# EAGLE schematic LowTemp_singleboard (EAGLE 6.4)
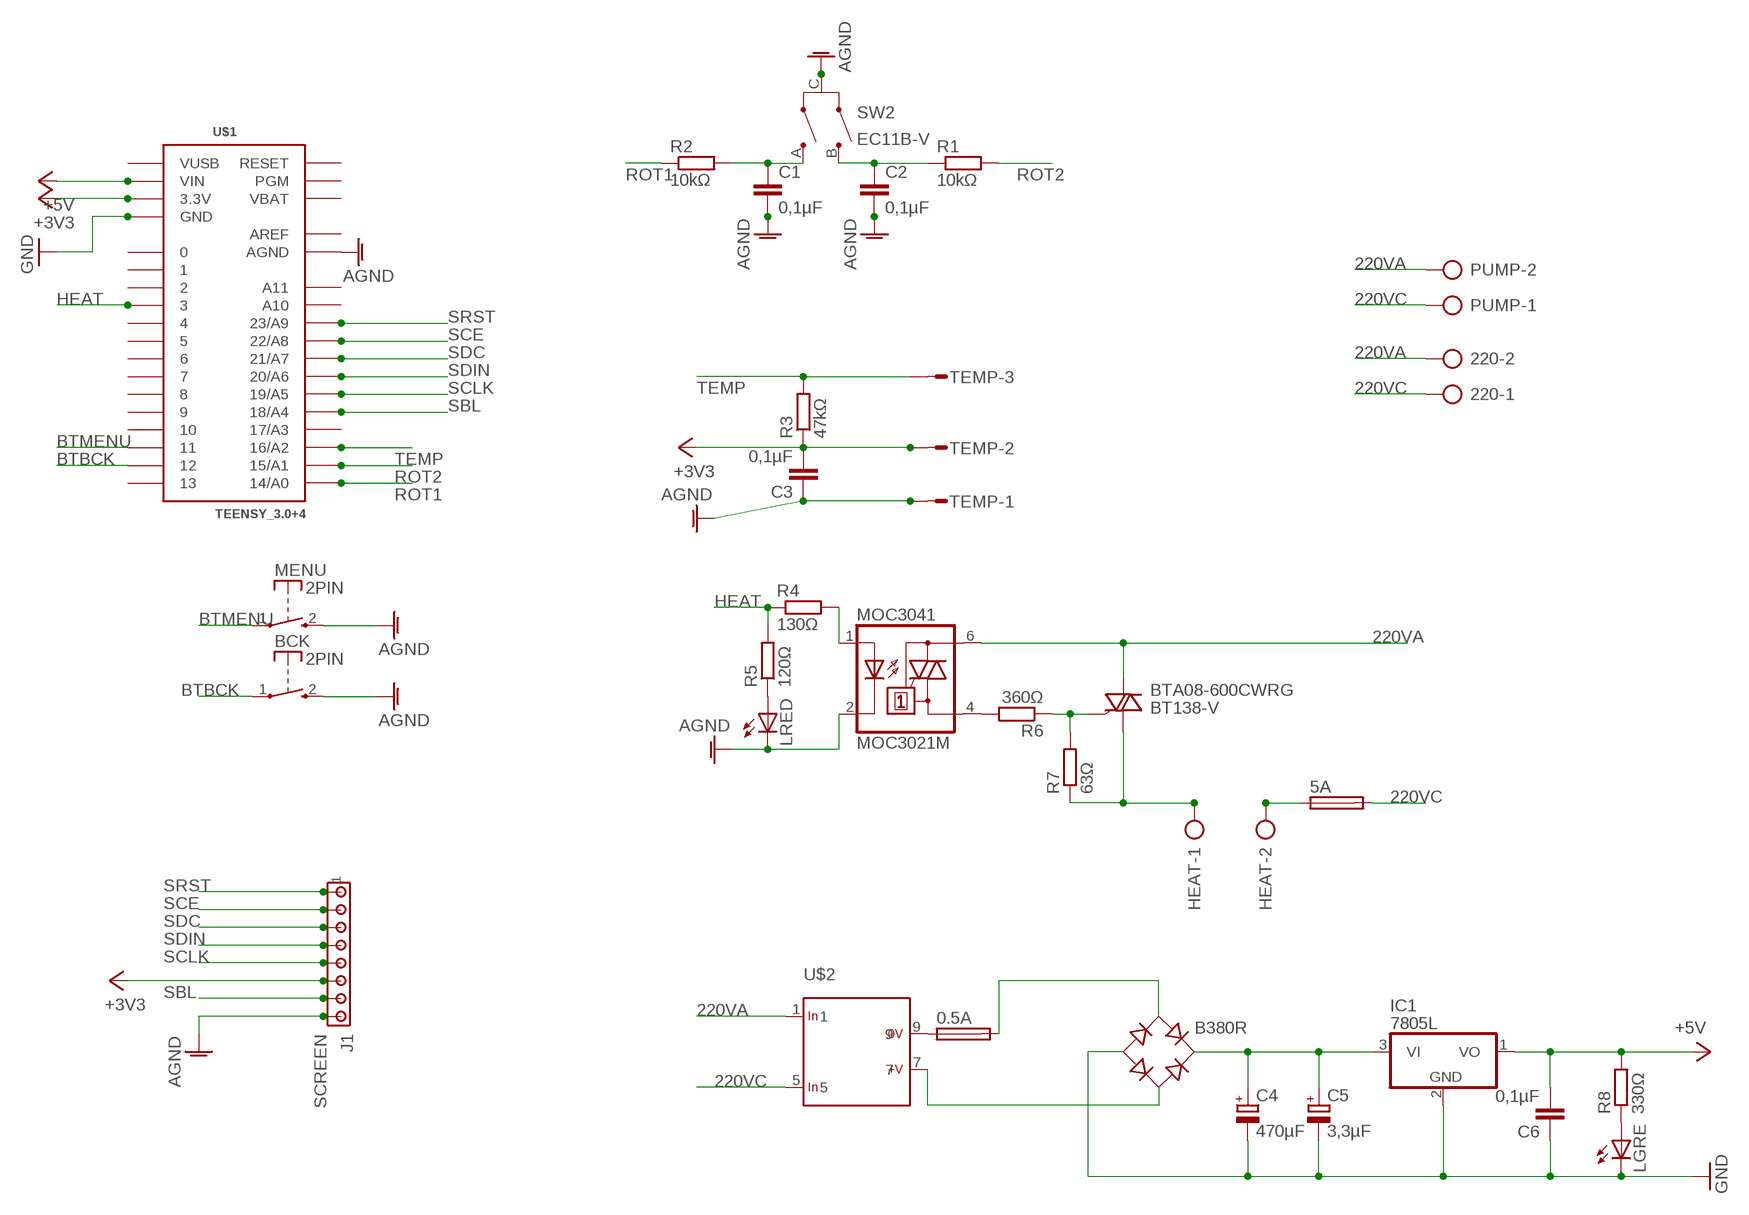
[diagram p0: schematic, sheet 1]

## Parts
0.5A  SH22,5A  [SH22,5A]
5A  SH22,5A  [SH22,5A]
220  AK500/2-H  [AK500/2-H]
B380R  RB1A  [RB1A]
BCK  2PIN  [2PIN]
BTA08-600CWRG  BT138-V  [TO220BV]
C1  0,1µF  C-EU050-025X075  [C050-025X075]
C2  0,1µF  C-EU050-025X075  [C050-025X075]
C3  0,1µF  C-EU050-025X075  [C050-025X075]
C4  470µF  CPOL-EUE5-8.5  [E5-8,5]
C5  3,3µF  CPOL-EUTT2D4  [TT2D4]
C6  0,1µF  C-EU050-025X075  [C050-025X075]
HEAT  AK500/2-H  [AK500/2-H]
IC1  7805L  [TO92]
J1  SCREEN  MTA08-100  [10X08MTA]
LGRE  LED5MM  [LED5MM]
LRED  LED5MM  [LED5MM]
MENU  2PIN  [2PIN]
MOC3041  MOC3021M  [DIL06]
PUMP  AK500/2-H  [AK500/2-H]
R1  10kΩ  R-EU_0207/7  [0207/7]
R2  10kΩ  R-EU_0207/7  [0207/7]
R3  47kΩ  R-EU_0207/7  [0207/7]
R4  130Ω  R-EU_0207/7  [0207/7]
R5  120Ω  R-EU_0207/7  [0207/7]
R6  360Ω  R-EU_0207/7  [0207/7]
R7  63Ω  R-EU_0207/7  [0207/7]
R8  330Ω  R-EU_0207/7  [0207/7]
SW2  EC11B-V  [EC11B-V]
TEMP  S03P  [S03P]
U$1  TEENSY_3.0+4  [TEENSY_3.0+4]
U$2  SINGLE  [1]

## Nets
220VA: 220.2 BTA08-600CWRG.T2(A2) MOC3041.6(A2) PUMP.2 U$2.1
220VC: 5A.2 220.1 PUMP.1 U$2.5
+3V3: C3.2 J1.6 R3.1 TEMP.2 U$1.3.3V U$1.3.3V1(3.3V)
+5V: C6.2 IC1.1(VO) R8.2 U$1.VIN
AGND: BCK.2(S) C1.2 C2.2 C3.1 J1.8 LRED.K(C) MENU.2(S) MOC3041.2(C) SW2.C TEMP.1 U$1.AGND
BTBCK: BCK.1(P) U$1.12
BTMENU: MENU.1(P) U$1.11
GND: B380R.- C4.- C5.- C6.1 IC1.2(GND) LGRE.K(C) U$1.GND U$1.GND1(GND)
HEAT: R4.1 R5.2 U$1.3
N$1: C1.1 R2.2 SW2.A
N$2: C2.1 R1.1 SW2.B
N$3: MOC3041.1(A) R4.2
N$4: LRED.A R5.1
N$5: MOC3041.4(A1) R6.2
N$6: BTA08-600CWRG.G R6.1 R7.2
N$7: 0.5A.1 U$2.9
N$8: BTA08-600CWRG.T1(A1) HEAT.1 R7.1
N$9: 5A.1 HEAT.2
N$10: B380R.AC2 U$2.7
N$11: 0.5A.2 B380R.AC1
N$13: B380R.+ C4.+ C5.+ IC1.3(VI)
N$15: LGRE.A R8.1
ROT1: R2.1 U$1.14/A0
ROT2: R1.2 U$1.15/A1
SBL: J1.7 U$1.18/A4
SCE: J1.2 U$1.22/A8
SCLK: J1.5 U$1.19/A5
SDC: J1.3 U$1.21/A7
SDIN: J1.4 U$1.20/A6
SRST: J1.1 U$1.23/A9
TEMP: R3.2 TEMP.3 U$1.16/A2
Unconnected: U$1.0 U$1.1 U$1.2 U$1.4 U$1.5 U$1.6 U$1.7 U$1.8 U$1.9 U$1.10 U$1.13 U$1.17/A3 U$1.A10 U$1.A11 U$1.PGM U$1.RESET

## Power pins joined to a net without a drawn wire
AREF: U$1.AREF
VBAT: U$1.VBAT
VUSB: U$1.VUSB

## Library data of the parts
0.5A 5A = fuse:SH22,5A: FUSE HOLDER grid 22,5mm, isolated cap OGN0031 8201, Schurter (Buerklin); MPN: 0031.7701.11; OC_FARNELL: unknown; OC_NEWARK: 04F1224
220 HEAT PUMP = con-ptr500:AK500/2-H: CONNECTOR Aug. 2004 / PTR Meßtechnik: Die Bezeichnung der Serie AK505 wurde geändert. Es handelt sich hierbei um AK500 in horizontaler Ausführung.; OC_FARNELL: unknown; OC_NEWARK: unknown
B380R = rectifier:RB1A: RECTIFIER 1 A
BCK MENU = switch-misc:2PIN
BTA08-600CWRG = triac:BT138: TRIAC Source: http://www.semiconductors.philips.com BT138_SERIES_2.pdf
C1-C3 C6 = resistor:C-EU: CAPACITOR, European symbol
C4 C5 = resistor:CPOL-EU: POLARIZED CAPACITOR, European symbol
IC1 = linear:78*: Positive VOLTAGE REGULATOR Source: http://cache.national.com/ds/LM/LM78L05.pdf http://www.fairchildsemi.com/ds/LM/LM7805.pdf
J1 = con-amp:MTA08-100: AMP connector
LGRE LRED = led:LED: LED OSRAM: - CHIPLED LG R971, LG N971, LY N971, LG Q971, LY Q971, LO R971, LY R971 LH N974, LH R974 LS Q976, LO Q976, LY Q976 LO Q996 - Hyper CHIPLED LW Q18S LB Q993, LB Q99A, LB R99A - SideLED LS A670, LO A670, LY A670, LG A670, LP A670 LB A673, LV A673, LT A673, LW A673 LH A674 LY A675 LS A676, LA A676, LO A676, LY A676, LW A676 LS A679, LY A679, LG A679 - Hyper Micro SIDELED® LS Y876, LA Y876, LO Y876, LY Y876 LT Y87S - SmartLED LW L88C, LW L88S LB L89C, LB L89S, LG L890 LS L89K, LO L89K, LY L89K LS L896, LA L896, LO L896, LY L896 - TOPLED LS T670, LO T670, LY T670, LG T670, LP T670 LSG T670, LSP T670, LSY T670, LOP T670, LYG T670 LG T671, LOG T671, LSG T671 LB T673, LV T673, LT T673, LW T673 LH T674 LS T676, LA T676, LO T676, LY T676, LB T676, LH T676, LSB T676, LW T676 LB T67C, LV T67C, LT T67C, LS T67K, LO T67K, LY T67K, LW E67C LS E67B, LA E67B, LO E67B, LY E67B, LB E67C, LV E67C, LT E67C LW T67C LS T679, LY T679, LG T679 LS T770, LO T770, LY T770, LG T770, LP T770 LB T773, LV T773, LT T773, LW T773 LH T774 LS E675, LA E675, LY E675, LS T675 LS T776, LA T776, LO T776, LY T776, LB T776 LHGB T686 LT T68C, LB T68C - Hyper Mini TOPLED® LB M676 - Mini TOPLED Santana® LG M470 LS M47K, LO M47K, LY M47K Source: http://www.osram.convergy.de LUXEON: - LUMILED® LXK2-PW12-R00, LXK2-PW12-S00, LXK2-PW14-U00, LXK2-PW14-V00 LXK2-PM12-R00, LXK2-PM12-S00, LXK2-PM14-U00 LXK2-PE12-Q00, LXK2-PE12-R00, LXK2-PE12-S00, LXK2-PE14-T00, LXK2-PE14-U00 LXK2-PB12-K00, LXK2-PB12-L00, LXK2-PB12-M00, LXK2-PB14-N00, LXK2-PB14-P00, LXK2-PB14-Q00 LXK2-PR12-L00, LXK2-PR12-M00, LXK2-PR14-Q00, LXK2-PR14-R00 LXK2-PD12-Q00, LXK2-PD12-R00, LXK2-PD12-S00 LXK2-PH12-R00, LXK2-PH12-S00 LXK2-PL12-P00, LXK2-PL12-Q00, LXK2-PL12-R00 Source: www.luxeon.com KINGBRIGHT: KA-3528ASYC Source: www.kingbright.com
MOC3041 = optocoupler:MOC30*M: RANDOM-PHASE OPTOISOLATORS TRIAC DRIVER OUTPUT Source: http://www.fairchildsemi.com MOC3020-M.pdf; MF: FAIRCHILD SEMICONDUCTOR; MPN: MOC3021-M; OC_FARNELL: 1021365; OC_NEWARK: 95B7895
R1-R8 = resistor:R-EU_: RESISTOR, European symbol
SW2 = alps:EC11B-V: ALPS EC11B Vertikal Ohne Taster Drehimpulsgeber 11 mm
TEMP = con-amp-mt:S03P: AMP MT CONNECTOR; OC_FARNELL: unknown; OC_NEWARK: unknown
U$1 = Teensy3.0:TEENSY_3.0+4: Teensy 3.0 board, showing all pins that are easily acessible. See 'AllAnalogPins" and 'AllPins' packages for additional pin holes, as needed. The 'Basic' package has fewer pins.
U$2 = myrra:SINGLE: One Output Input voltage range: 85 to 265 V AC or 85 to 370 V DC Input frequency: 47 to 440 Hz Output voltage accuracy (full load ): ± 2% Line output voltage variation: ± 0.3% Load output voltage variation: ± 0.5% Temperature range: -25 - TA (°C) No load input power: < 200mW regulated: Reference Output Current Power Efficiency Ta Volts mA Watts % °C 47121 3.3 750 2.5 65 +70 47122 5 550 2.75 68 +70 47123 9 270 2.5 72 +70 47124 12 210 2.5 74 +70 47125 15 170 2.5 75 +70 47126 24 110 2.5 77 +70 47151 3.3 1350 4.2 65 +50 47152 5 900 4.5 68 +50 47153 9 550 5 72 +50 47154 12 420 5 75 +50 47155 15 320 5 76 +50 47156 24 220 5 79 +50 non regulated: Reference Output Current Power Efficiency Ta Volts mA Watts % °C 47114 12 200 2.4 74 +70 47133 9 360 3.2 73 +70 47134 12 270 3.2 75 +70 47136 24 130 3.2 80 +70 47163 9 560 5* 73 +50 47164 12 420 5* 75 +50 47166 24 210 5* 80 +50 * Nota: Power up to 5.4W is possible with input voltage > 97 V AC Source: http://www.myrra.com